# EAGLE design NANO_SIMPLE_walkie-talkie (EAGLE 9.5.2)
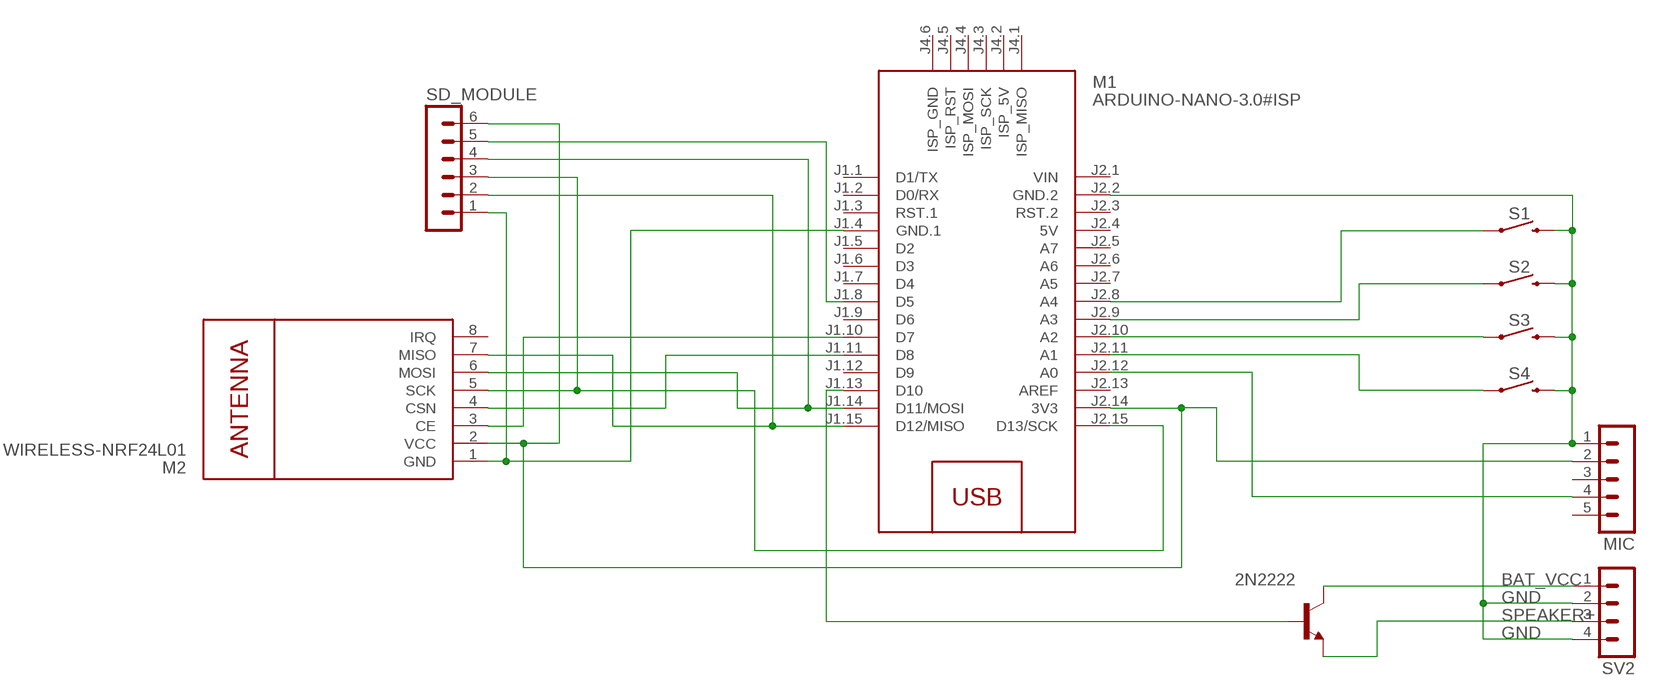
[diagram p0: schematic, sheet 1]

## Parts
M1  ARDUINO-NANO-3.0#ISP  [ARDUINO-NANO-3.0#ISP]
M2  WIRELESS-NRF24L01  [WIRELESS-NRF24L01]
MIC  MA05-1  [MA05-1]
S1  MOMENTARY-SWITCH-SPST-PTH-6.0MM  [TACTILE_SWITCH_PTH_6.0MM]
S2  MOMENTARY-SWITCH-SPST-PTH-6.0MM  [TACTILE_SWITCH_PTH_6.0MM]
S3  MOMENTARY-SWITCH-SPST-PTH-6.0MM  [TACTILE_SWITCH_PTH_6.0MM]
S4  MOMENTARY-SWITCH-SPST-PTH-6.0MM  [TACTILE_SWITCH_PTH_6.0MM]
SD_MODULE  MA06-1  [MA06-1]
SV2  MA04-1  [MA04-1]
T1  2N2222  [TO18]

## Nets
6: M1.J2.14(3V3) M2.2(VCC) MIC.2 SD_MODULE.6
BAT_VCC: SV2.1 T1.3(C)
GND: M1.J2.2(GND.2) MIC.1 S1.3 S2.3 S3.3 S4.3 SV2.2 SV2.4
N$1: M1.J1.8(D5) SD_MODULE.5
N$2: M1.J1.4(GND.1) M2.1(GND) SD_MODULE.1
N$3: M1.J1.10(D7) M2.3(CE)
N$4: M1.J1.11(D8) M2.4(CSN)
N$5: M1.J2.15(D13/SCK) M2.5(SCK) SD_MODULE.3
N$6: M1.J1.14(D11/MOSI) M2.6(MOSI) SD_MODULE.4
N$7: M1.J1.15(D12/MISO) M2.7(MISO) SD_MODULE.2
N$8: M1.J2.11(A1) S4.1
N$9: M1.J2.10(A2) S3.1
N$10: M1.J2.9(A3) S2.1
N$11: M1.J2.8(A4) S1.1
N$13: M1.J1.13(D10) T1.2(B)
N$14: M1.J2.12(A0) MIC.4
SPEAKER+: SV2.3 T1.1(E)
Unconnected: M1.J1.1(D1/TX) M1.J1.2(D0/RX) M1.J1.3(RST.1) M1.J1.5(D2) M1.J1.6(D3) M1.J1.7(D4) M1.J1.9(D6) M1.J1.12(D9) M1.J2.3(RST.2) M1.J2.5(A7) M1.J2.6(A6) M1.J2.7(A5) M1.J2.13(AREF) M1.J4.1(ISP_MISO) M1.J4.2(ISP_5V) M1.J4.3(ISP_SCK) M1.J4.4(ISP_MOSI) M1.J4.5(ISP_RST) M1.J4.6(ISP_GND) M2.8(IRQ) MIC.3 MIC.5

## Power pins joined to a net without a drawn wire
5V: M1.J2.4(5V)
VIN: M1.J2.1(VIN)

## Library data of the parts
M1 = diy-modules:ARDUINO-NANO-3.0#ISP: Arduino Nano 3.0 (and compatible devices) with ISP pads More details available here: https://www.arduino.cc/en/Main/ArduinoBoardNano Click here to find device on ebay.com <http://www.ebay.com/sch/arduino+nano>
M2 = diy-modules:WIRELESS-NRF24L01: 2.4 GHz Wireless Module based on NRF24L01 chip More details available here: http://www.electrodragon.com/w/NRF24L01 Click here to find device on ebay.com <http://www.ebay.com/sch/nrf24l01+arduino>
MIC = con-lstb:MA05-1: PIN HEADER; OC_FARNELL: unknown; OC_NEWARK: unknown
S1-S4 = SparkFun-Switches:MOMENTARY-SWITCH-SPST: Momentary Switch (Pushbutton) - SPST Normally-open (NO) SPST momentary switches (buttons, pushbuttons). Variants PTH-12MM - 12mm square, through-hole Momentary Pushbutton Switch - 12mm Square <https://www.sparkfun.com/products/9190> (COM-09190) PTH-6.0MM, PTH-6.0MM-KIT - 6.0mm square, through-hole Mini Pushbutton Switch <https://www.sparkfun.com/products/97> (COM-00097) KIT package intended for soldering kit's - only one side of pads' copper is exposed. PTH-RIGHT-ANGLE-KIT - Right-angle, through-hole Right Angle Tactile Button <https://www.sparkfun.com/products/10791> - Used on SparkFun BigTime Watch Kit <https://www.sparkfun.com/products/11734> SMD-12MM - 12mm square, surface-mount Tactile Button - SMD (12mm) <https://www.sparkfun.com/products/12993> (COM-12993) Used on SparkFun PicoBoard <https://www.sparkfun.com/products/11888> SMD-4.5MM - 4.5mm Square Trackball Switch Used on SparkFun Blackberry Trackballer Breakout <https://www.sparkfun.com/products/13169> SMD-4.6MMX2.8MM - 4.60mm x 2.80mm, surface mount Used on SparkFun SAMD21 Mini Breakout <https://www.sparkfun.com/products/13664> SMD-5.2MM, SMD-5.2-REDUNDANT - 5.2mm square, surface-mount Mini Pushbutton Switch - SMD <https://www.sparkfun.com/products/8720> (COM-08720) Used on Arduino Pro Mini <https://www.sparkfun.com/products/11114> REDUNDANT package connects both switch circuits together SMD-6.0X3.5MM - 6.0 x 3.5mm, surface mount Momentary Reset Switch SMD <https://www.sparkfun.com/products/8229> (COM-08229) SMD-6.2MM-TALL - 6.2mm square, surface mount Tactile Button - SMD (6mm) <https://www.sparkfun.com/products/12992> Used on SparkFun Digital Sandbox <https://www.sparkfun.com/products/12651> SMD-RIGHT-ANGLE - Right-angle, surface mount Used on SparkFun Block for Intel® Edison - Arduino <https://www.sparkfun.com/products/13036>; PROD_ID: SWCH-08441; SF_SKU: COM-00097
SD_MODULE = con-lstb:MA06-1: PIN HEADER; OC_FARNELL: unknown; OC_NEWARK: unknown
SV2 = con-lstb:MA04-1: PIN HEADER; OC_FARNELL: unknown; OC_NEWARK: unknown
T1 = transistor:2N2222: NPN TRANSISTOR

## Board
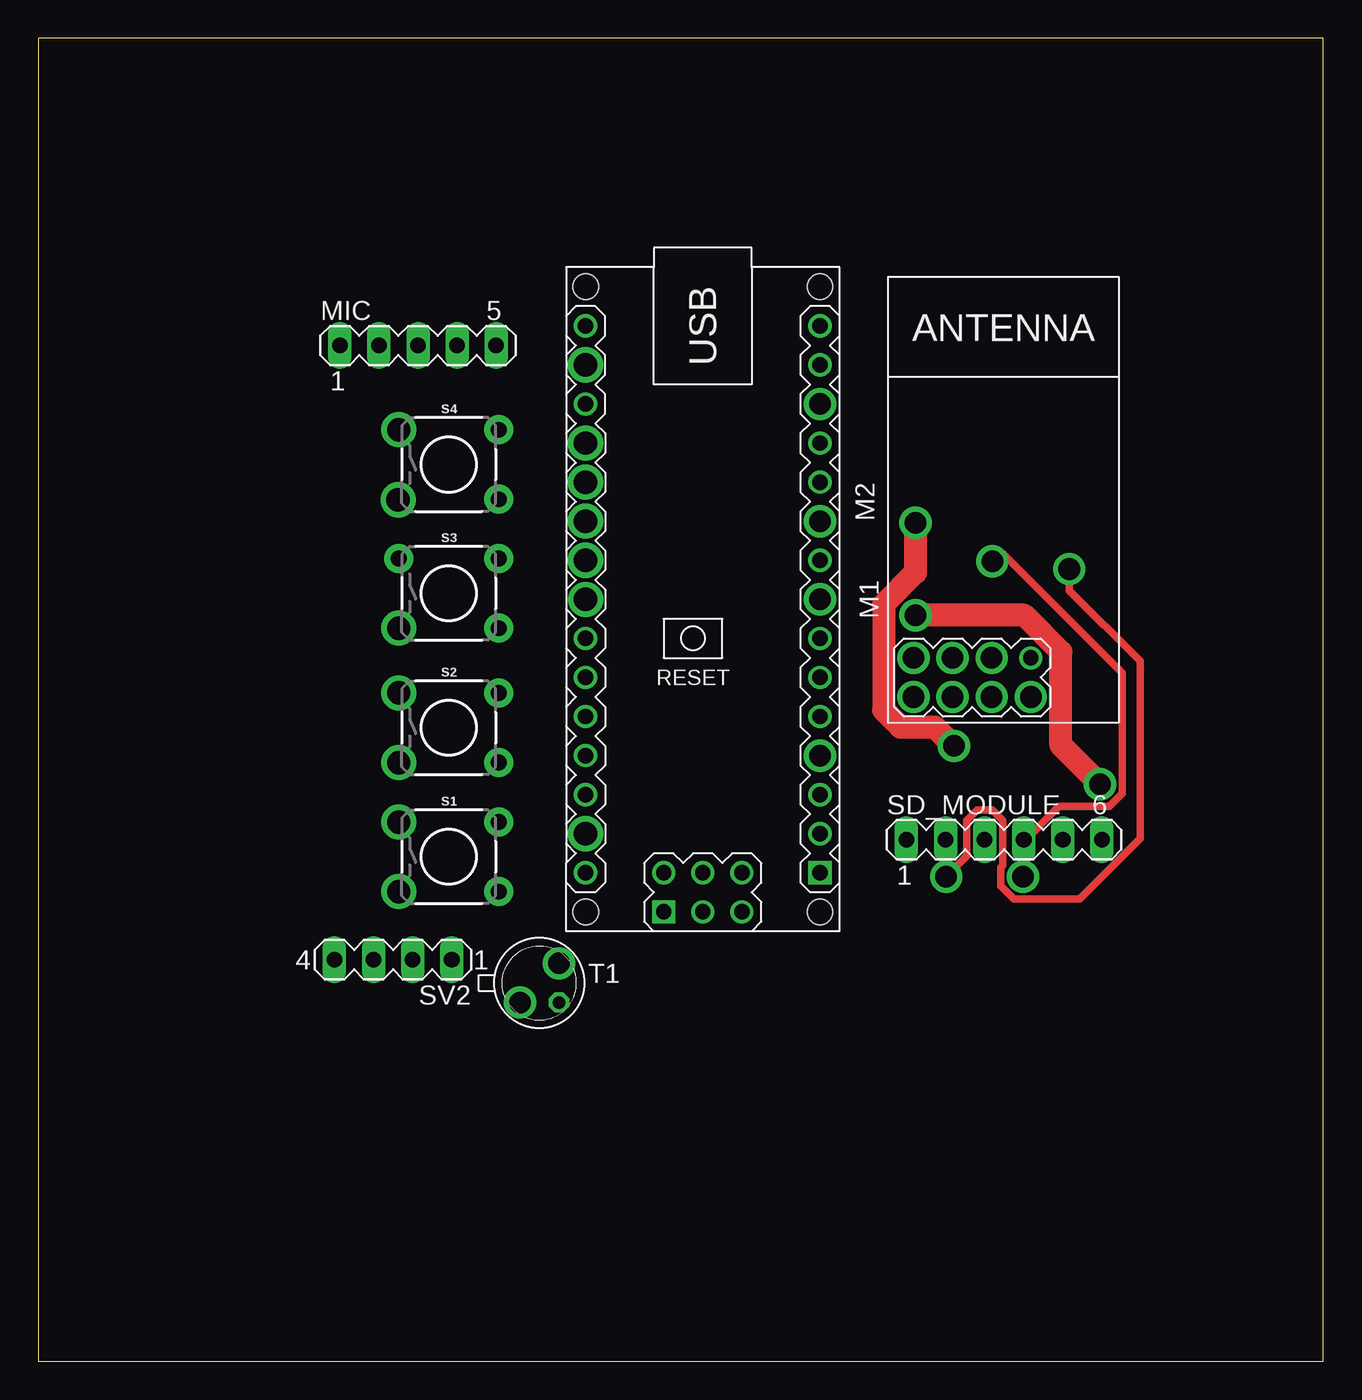
[diagram p1: board, top side]
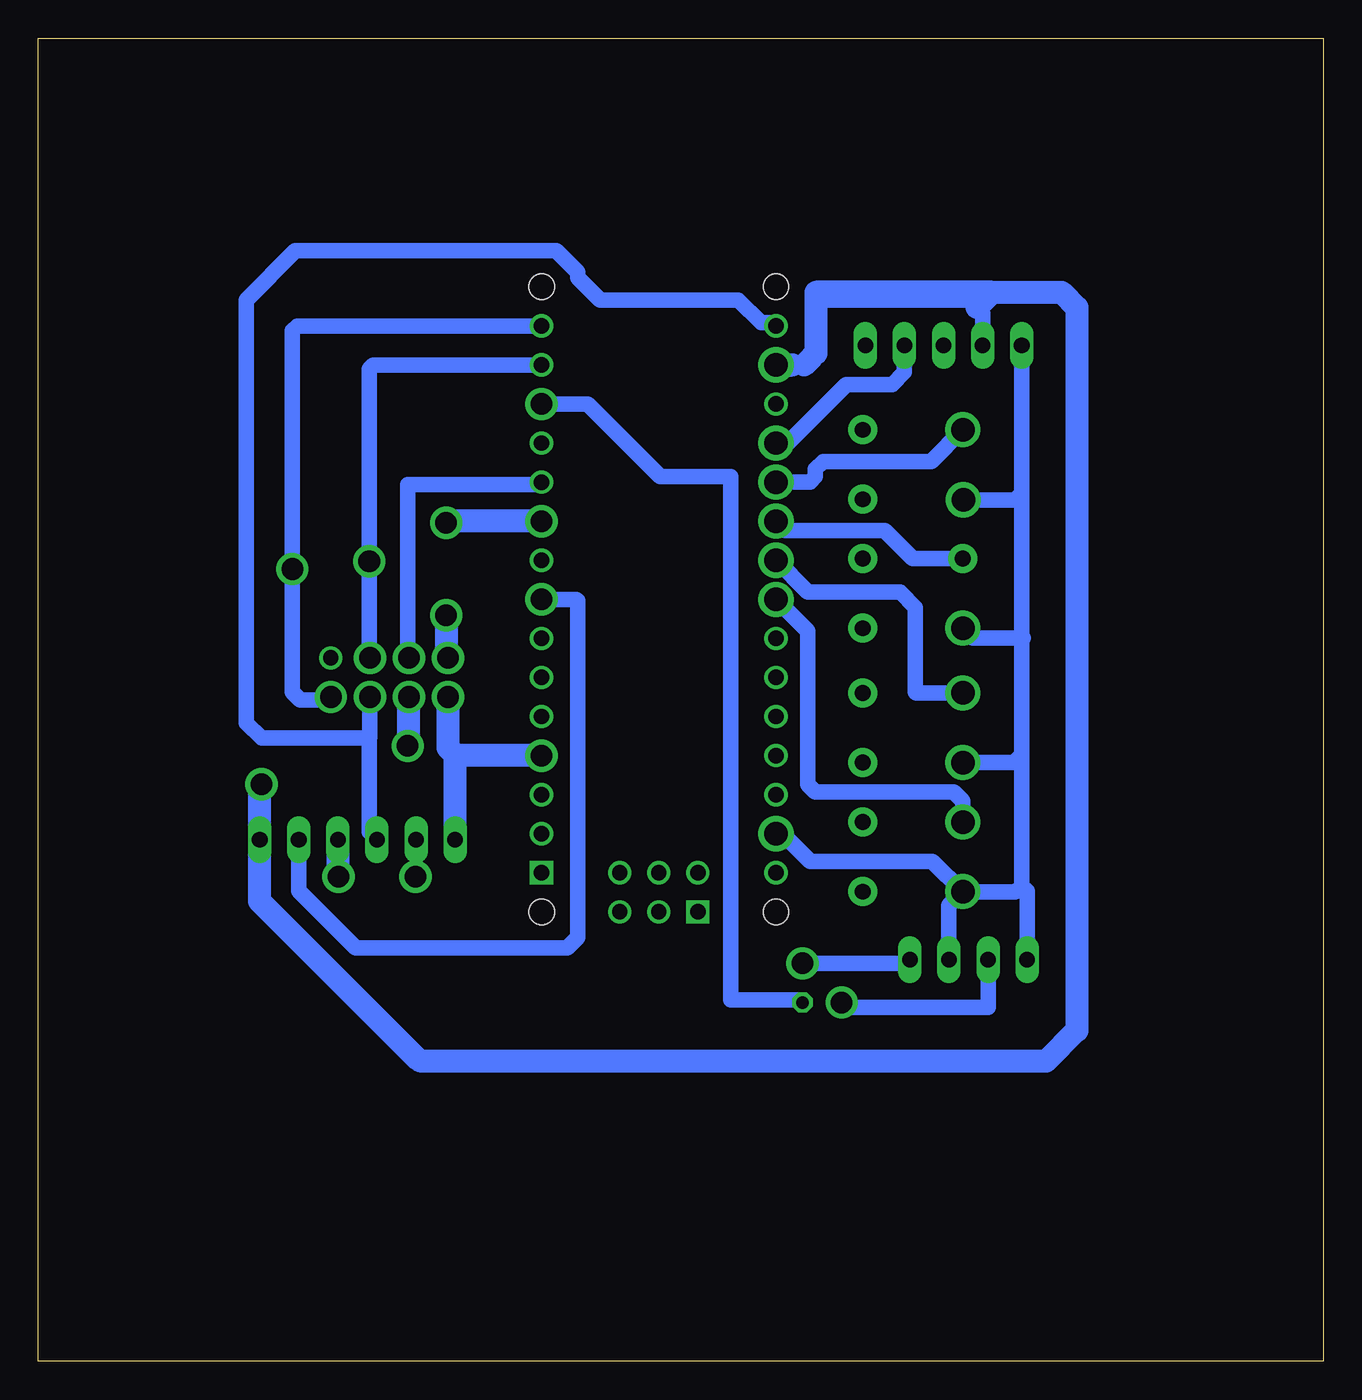
[diagram p2: board, bottom side, seen from below]

Size 83.5 x 86 mm. Coordinates in mm from the lower left corner, seen from the top.
Outline: 0,0 83.5,0 83.5,86 0,86 0,0
Copper layers (1*16): Top 0.035mm / dielectric 1.5mm / Bottom 0.035mm
Design rules "default": minimum track width 6mil, minimum drill 0.35mm, track to track 6mil, track to pad 6mil, pad to pad 6mil, via to via 6mil, smd to smd 6mil, copper to edge 40mil, drill to drill 6mil, minimum pad ring 10mil, minimum via ring 8mil, stop-mask expansion 4mil, vias tented up to drill 0mil, thermal gap 10mil

### Footprints (pad centres in the part's own frame; a part is rotated, then mirrored left to right if it is on the bottom)
ARDUINO-NANO-3.0#ISP = drill 1 square: J1.1 17.78,7.62; J4.1 20.32,-2.54 | drill 1: J1.2 15.24,7.62; J1.3 12.7,7.62; J1.4 10.16,7.62; J1.5 7.62,7.62; J1.6 5.08,7.62; J1.7 2.54,7.62; J1.8 0,7.62; J1.9 -2.54,7.62; J1.10 -5.08,7.62; J1.11 -7.62,7.62; J1.12 -10.16,7.62; J1.13 -12.7,7.62; J1.14 -15.24,7.62; J1.15 -17.78,7.62; J2.1 17.78,-7.62; J2.2 15.24,-7.62; J2.3 12.7,-7.62; J2.4 10.16,-7.62; J2.5 7.62,-7.62; J2.6 5.08,-7.62; J2.7 2.54,-7.62; J2.8 0,-7.62; J2.9 -2.54,-7.62; J2.10 -5.08,-7.62; J2.11 -7.62,-7.62; J2.12 -10.16,-7.62; J2.13 -12.7,-7.62; J2.14 -15.24,-7.62; J2.15 -17.78,-7.62; J4.2 17.78,-2.54; J4.3 20.32,0; J4.4 17.78,0; J4.5 20.32,2.54; J4.6 17.78,2.54 | hole 1.651: -20.32,7.62; -20.32,-7.62; 20.32,-7.62; 20.32,7.62
WIRELESS-NRF24L01 = drill 1 square: 1 -12.7,6.35 | drill 1: 2 -10.16,6.35; 3 -12.7,3.81; 4 -10.16,3.81; 5 -12.7,1.27; 6 -10.16,1.27; 7 -12.7,-1.27; 8 -10.16,-1.27
MA05-1 = drill 1.016 long: 1 -5.08,0; 2 -2.54,0; 3 0,0; 4 2.54,0; 5 5.08,0
TACTILE_SWITCH_PTH_6.0MM = drill 1.016 pad 1.88: 1 -3.251,2.261; 2 3.251,2.261; 3 -3.251,-2.261; 4 3.251,-2.261
MA06-1 = drill 1.016 long: 1 -6.35,0; 2 -3.81,0; 3 -1.27,0; 4 1.27,0; 5 3.81,0; 6 6.35,0
MA04-1 = drill 1.016 long: 1 -3.81,0; 2 -1.27,0; 3 1.27,0; 4 3.81,0
TO18 = drill 0.813 octagon: 1 -1.27,-1.27; 2 1.27,-1.27; 3 1.27,1.27

### Placement (x,y rotation side)
M1  43.18,49.53 270 top
M2  63.23,55.88 90 top
MIC  24.67,66.04 0 top
S1  26.67,32.79 0 top
S2  26.67,41.18 0 top
S3  26.67,49.92 0 top
S4  26.67,58.3 0 top
SD_MODULE  62.77,33.9 0 top
SV2  23.05,26.1 180 top
T1  32.56,24.59 0 top

### Tracks (layer width: path | path; a pad name or v marks a point on that pad's centre or on a via)
6  (via drill 1.4 pad 1, 1.52 pad 0.51)
  Top 1.5: v69,37.5 66.45,40.05 66.45,46.11 64.06,48.5 v57,48.5
  Bottom 1: 22.13,68.13 22.5,68.5
  Bottom 1.016: MIC.2 22.13,68.13 | 32.97,65.53 33.21,65.29 33.21,69 23,69 22.5,68.5 | 33.73,64.77 34.5,64.77
  Bottom 1.5: 22.5,68.5 21.5,69.5 | 21.5,69.5 17,69.5 16,68.5 16,21.5 18,19.5 58.59,19.5 58.81,19.59 69.12,29.9 SD_MODULE.6 69.12,37.38 v69,37.5 | 21.5,69.5 32.97,69.5 32.97,65.53 | 33.21,65.29 33.73,64.77 | M1.J2.14 34.5,64.77 | v57,48.5 57,45.84 M2.2
  other vias: 35.56,64.77 56.88,45.72
BAT_VCC  (via drill 1.4 pad 1)
  Bottom 1: T1.3 27.1,25.86 SV2.1
  other vias: 33.83,25.86
GND  (via drill 1.52 pad 0.51)
  Bottom 1: SV2.2 24.32,29.63 S1.3 25.39,32.5 33.35,32.5 35.35,34.5 | SV2.4 19.24,30.56 19.59,30.91
  Bottom 1.016: MIC.1 19.59,56.41 | 19.59,56.41 20,56 v23.38,56 S4.3 | 19.59,56.41 19.59,47.09 | 19.59,47.09 19.5,47 22.76,47 S3.3 | 19.59,47.09 19.59,39.41 | S2.3 20.08,38.92 19.59,39.41 | 19.59,39.41 19.59,30.91 20,30.5 23.39,30.5 S1.3 | 35.35,34.5 M1.J2.2
  other vias: 23.42,47.66 23.42,38.92 23.42,30.53 35.56,34.29
N$1  (via drill 1.4 pad 1)
  Bottom 1: M1.J1.8 48.53,49.53 48.46,49.46 48.46,27.54 49.13,26.87 62.87,26.87 66.58,30.58 SD_MODULE.5
  other vias: 50.8,49.53
N$2  (via drill 1.4 pad 1)
  Bottom 1.5: M1.J1.4 56.37,39.37 | M2.1 56.88,39.88 56.37,39.37 | SD_MODULE.1 56.42,39.32 56.37,39.37
  other vias: 50.8,39.37 56.88,43.18
N$3  (via drill 1.4 pad 1)
  Top 1.5: v57,54.5 57,51.26 54.93,49.19 54.93,42.35 56.05,41.23 58.27,41.23 v59.5,40
  Bottom 1.5: M1.J1.10 56.89,54.61 v57,54.5 | v59.5,40 59.42,40.08 M2.3
  other vias: 50.8,54.61 59.42,43.18
N$4  (via drill 1.4 pad 1)
  Bottom 1: M1.J1.11 50.95,57 59.5,57 59.5,45.8 M2.4
  other vias: 59.42,45.72
N$5  (via drill 1.4 pad 1)
  Bottom 1: M1.J2.15 35.76,67.51 36.53,67.51 38.02,69 47,69 48.46,70.46 48.46,70.82 49.83,72.19 66.81,72.19 70,69 70,41.5 69,40.5 62,40.5 | 62,40.5 61.96,40.54 M2.5 | SD_MODULE.3 62,34.4 62,40.5
  other vias: 61.96,43.18
N$6  (via drill 1.4 pad 1)
  Top 0.5: v62,52 62.5,52.5 62.69,52.5 70.45,44.74 70.45,36.9 69.6,36.05 66.32,36.05 64,33.73 v64,31.5
  Bottom 1: M1.J1.14 61.73,64.77 62,64.5 v62,52 62,45.76 M2.6
  Bottom 1.5: SD_MODULE.4 64.04,31.54 v64,31.5
  other vias: 61.96,45.72
N$7  (via drill 1.4 pad 1)
  Top 0.5: v59,31.5 60.34,32.84 60.34,35.14 61.02,35.83 61.98,35.83 62.66,35.14 62.66,32.22 62.55,32.1 62.55,30.9 63.4,30.05 67.68,30.05 71.61,33.98 71.61,45.51 67,50.12 v67,51.5
  Bottom 0.5: SD_MODULE.2 59,33.86 v59,31.5
  Bottom 1: M1.J1.15 66.69,67.31 67,67 v67,51.5 67,43.5 66.5,43 64.68,43 M2.7
  other vias: 64.5,43.18
N$8  (via drill 1.52 pad 0.51)
  Bottom 1.016: S4.1 25.48,58.5 32.5,58.5 33,58 33,57.5 33.35,57.15 M1.J2.11
  other vias: 23.42,60.56 35.56,57.15
N$9  (via drill 1.52 pad 0.51)
  Bottom 1.016: S3.1 26.68,52.18 28.5,54 34.95,54 M1.J2.10
  other vias: 35.56,54.61
N$10  (via drill 1.52 pad 0.51)
  Bottom 1.016: M1.J2.9 33.49,50 27.5,50 26.5,49 26.5,43.5 26.44,43.44 S2.1
  other vias: 23.42,43.44 35.56,52.07
N$11  (via drill 1.52 pad 0.51)
  Top 1.016: M1.J2.8
  Bottom 1.016: M1.J2.8 33.5,47.47 33.5,37.5 33,37 24,37 23.42,36.42 S1.1
  other vias: 23.42,35.05 35.57,49.52
N$13  (via drill 1.4 pad 1)
  Bottom 1: T1.2 34.01,23.5 38.5,23.5 38.5,57.5 43.07,57.5 47.8,62.23 M1.J1.13
  other vias: 50.8,62.23
N$14  (via drill 1.52 pad 0.51)
  Bottom 1.016: M1.J2.12 34.81,59.69 31,63.5 28,63.5 27.21,64.29 MIC.4
  other vias: 35.56,59.69
SPEAKER+  (via drill 1.4 pad 1)
  Bottom 1: SV2.3 21.78,23 30.97,23 T1.1
  other vias: 31.29,23.32